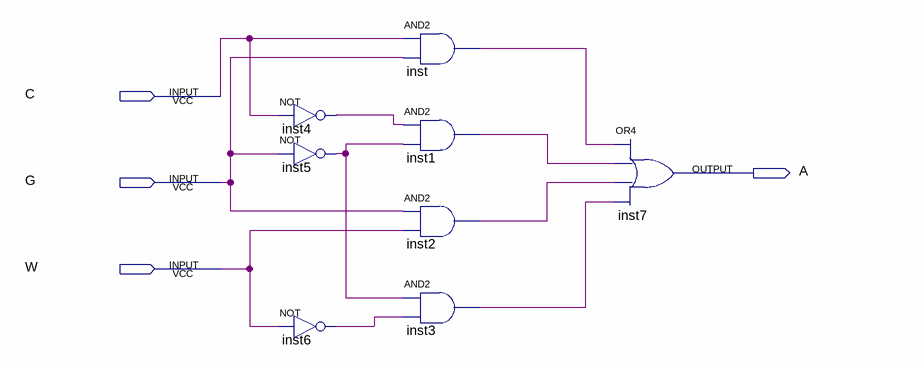
[diagram p0: schematic sheet]
// Quartus schematic lab2step2.bdf as structural Verilog: 8 symbols, 4 pins
module lab2step2 (
  input  C,
  input  G,
  input  W,
  output A
);

  wire inst1_out, inst2_out, inst3_out, inst4_out, inst5_out, inst6_out, inst_out;

  not inst4 (inst4_out, C);
  not inst5 (inst5_out, G);
  not inst6 (inst6_out, W);
  and inst (inst_out, C, G);
  and inst1 (inst1_out, inst4_out, inst5_out);
  and inst2 (inst2_out, G, W);
  and inst3 (inst3_out, inst5_out, inst6_out);
  or inst7 (A, inst_out, inst1_out, inst2_out, inst3_out);
endmodule
